# EasyEDA Pro project Jalousee PCB.eprj, schematic Jalousee PCB TC118S
Create Date: 2022-09-28; Page Name: P2; Project Name: Jalousee PCB; Schematic Name: Jalousee PCB TC118S; Update Date: 2023-08-31; Company: EasyEDA.com; Drawed: EasyEDA Pro; Page Size: A4; Part Number: JLCPCB-002; Reviewed: EasyEDA Pro; Version: V0.1
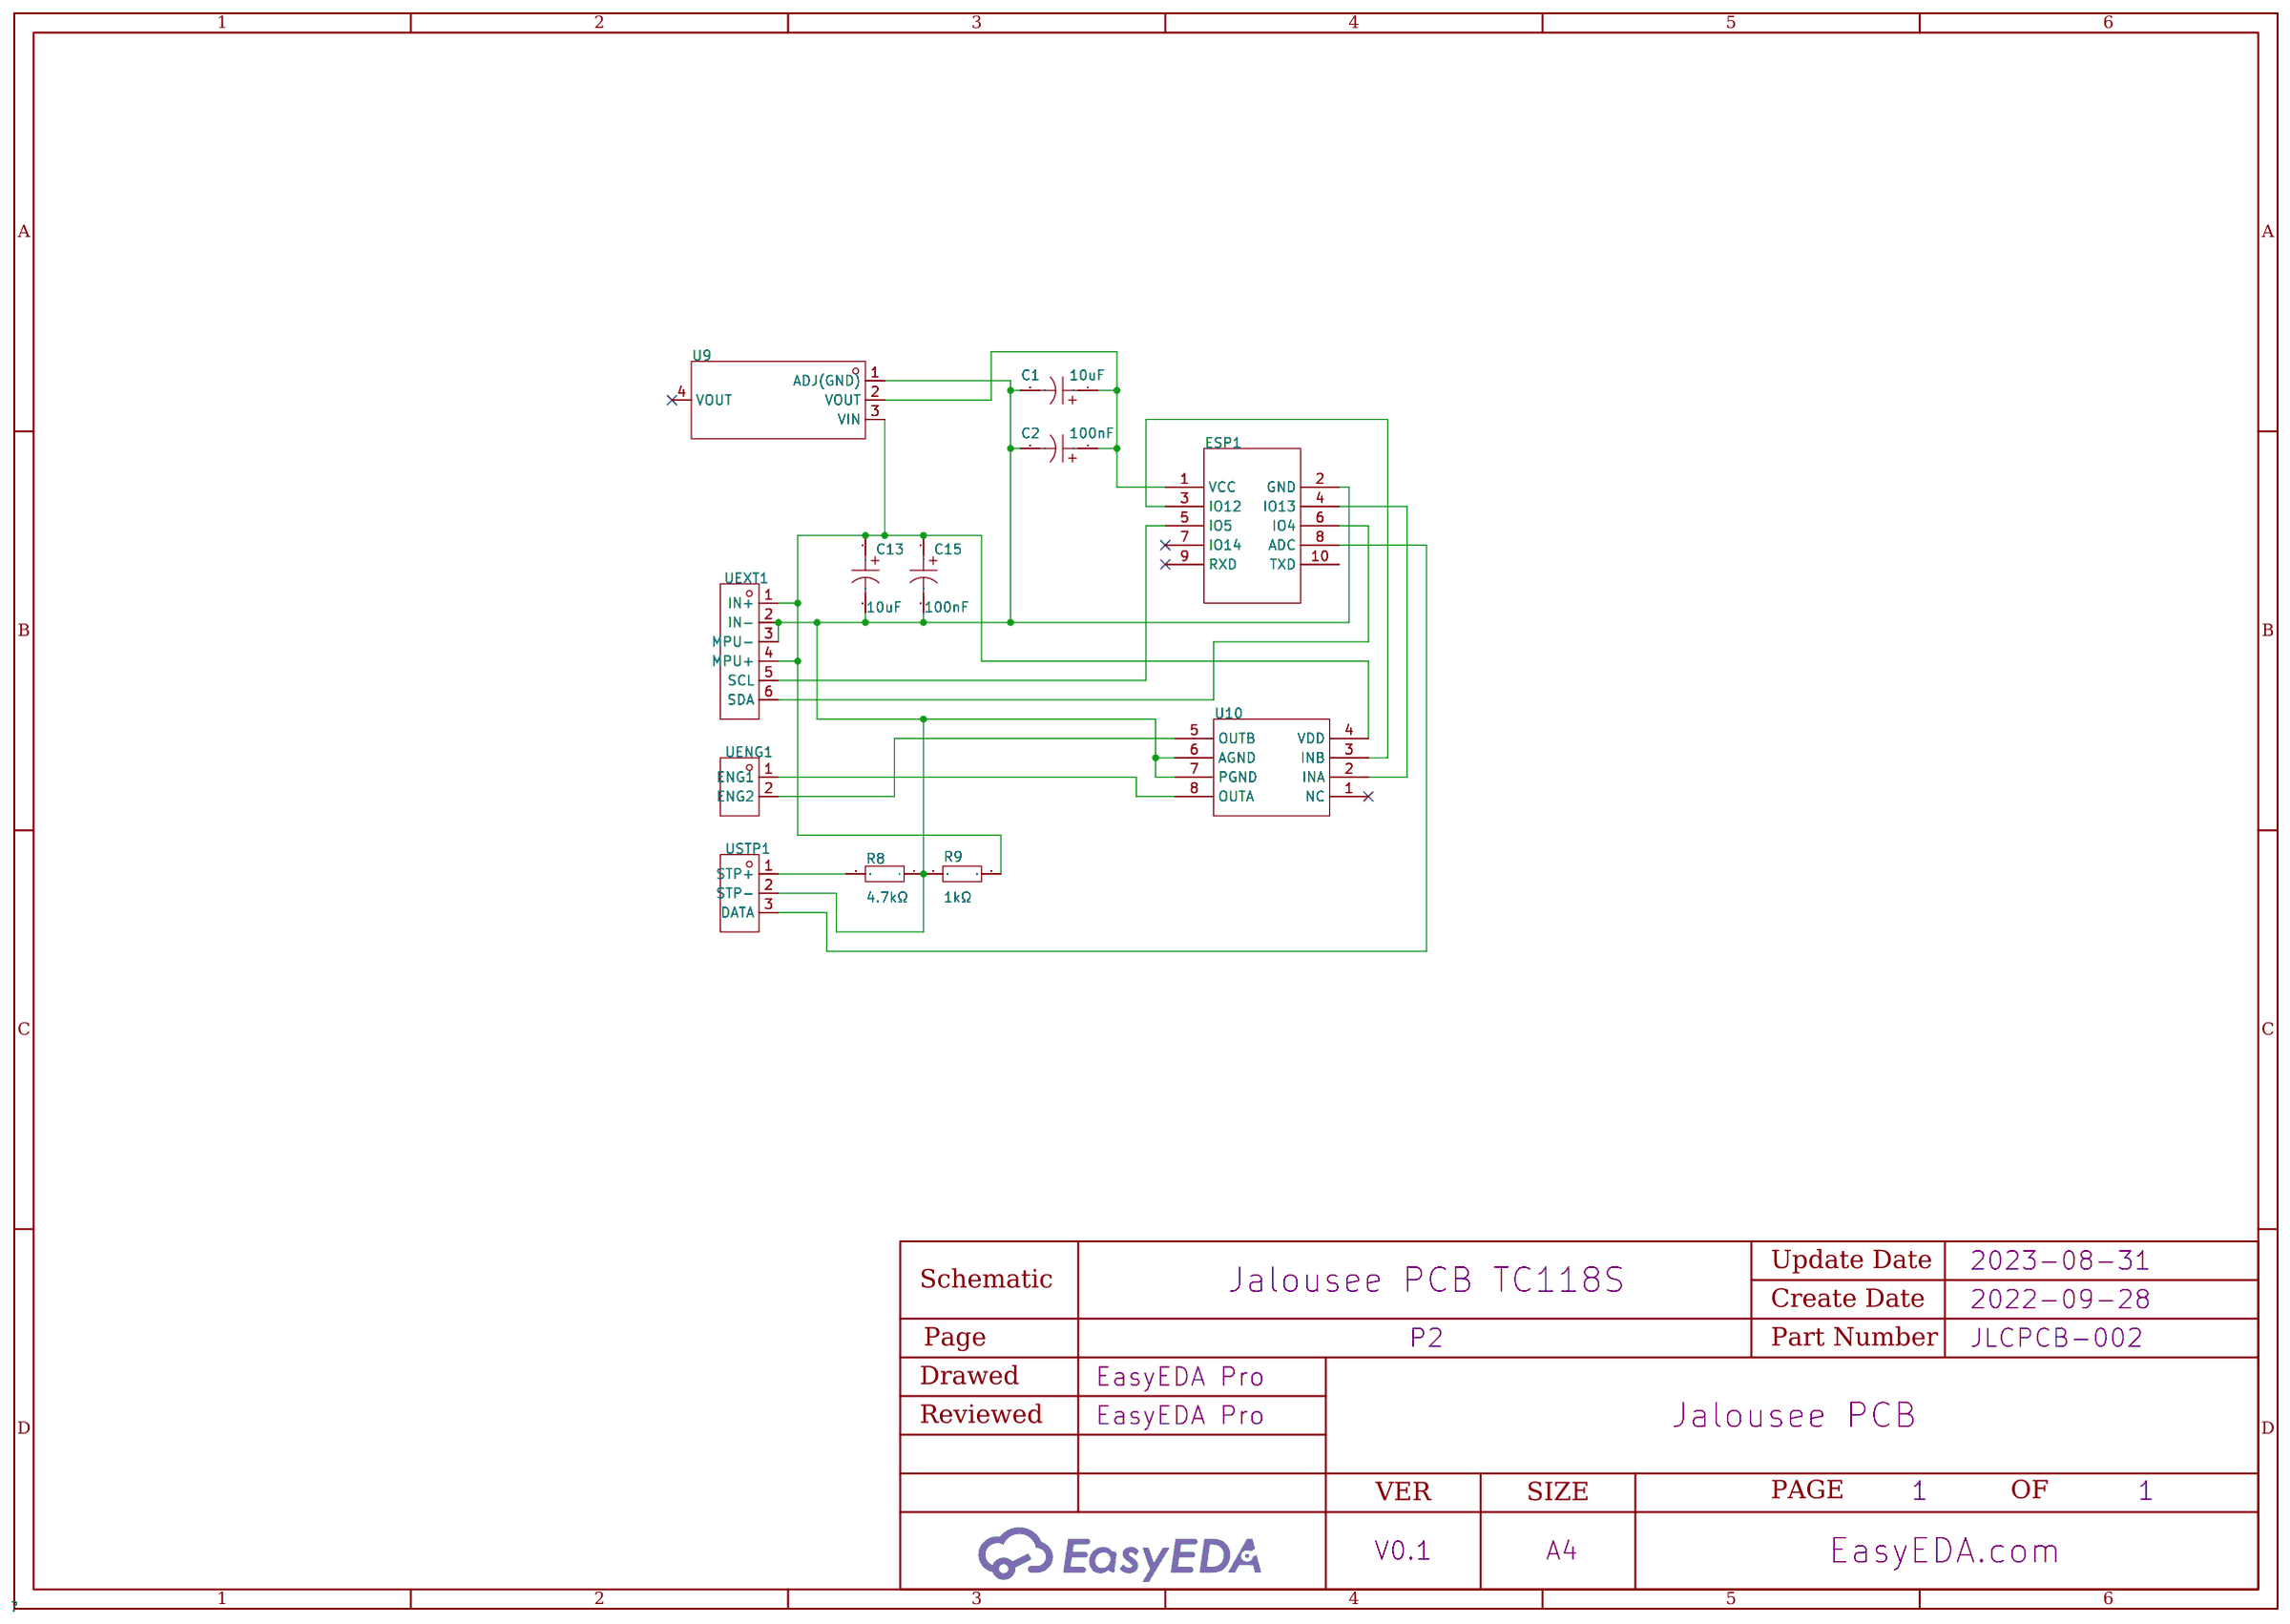
[diagram p2: schematic sheet]

## Parts
C1  10uF  [CAP-SMD_L2.0-W1.3-FD]
C2  100nF  [CAP-SMD_L3.2-W1.6-FD]
C13  10uF  [CAP-SMD_L2.0-W1.3-FD]
C15  100nF  [CAP-SMD_L3.2-W1.6-FD]
ESP1  -  [ESP12 10P]
R8  4.7kΩ  [R0603]
R9  1kΩ  [R0603]
U9  -  [SOT-223-3_L6.5-W3.4-P2.30-LS7.0-BR]
U10  -  [SOP-8_L4.9-W3.9-P1.27-LS6.0-BL]
UENG1  -  [CONN-TH_2P-P1.25_HCTL_HC-1.25-2A]
UEXT1  -  [HDR-TH_6P-P2.54-V-F]
USTP1  -  [CONN-TH_3P-P1.25_HCTL_HC-1.25-3A]

## Library data of the parts
C1 C13 = CA45-P-6.3V-10UF-K: Capacitance: Tolerance:±10% Tolerance:±10% Rated Voltage: Leakage Current(DCL):- Ripple Current:- Equivalent Series Resistance(ESR):-; LCSC Part Name: 10uF ±10% 6.3V; Supplier Part: C2844395; Manufacturer: CEC(振华新云); Supplier Footprint: CASE-P_2012; JLCPCB Part Class: Extended Part; Datasheet: https://atta.szlcsc.com/upload/public/pdf/source/20210702/C2844395_E7EBF1B65FEA8FC3CE954A9FCB08EE3D.pdf; Supplier: LCSC; Tolerance: ±10%
C2 C15 = T491A104M050AT: Capacitance:100nF Tolerance:±20% Tolerance:±20% Rated Voltage:50V Leakage Current(DCL):- Ripple Current:- Equivalent Series Resistance(ESR):20Ω Operating Temperature:-55~+125 Operating Temperature:-55~+125; LCSC Part Name: 100nF ±20% 50V; Supplier Part: C1952859; Manufacturer: KEMET(基美); Supplier Footprint: 1206; JLCPCB Part Class: Extended Part; Datasheet: https://atta.szlcsc.com/upload/public/pdf/source/20210416/95C0EC5B3581C9A90529545117ABEAC1.pdf; Supplier: LCSC; Tolerance: ±20%; Rated Voltage: 50V; Equivalent Series Resistance(ESR): 20Ω; Operating Temperature: -55~+125
ESP1 = ESP12-10P-3.3V-FH
R8 = RC0603JR-074K7L: Overload Voltage (Max): Operating Temperature Range: Operating Temperature Range: Body Length:- Tolerance: φD:- Body Height:- Body Width:- Resistance: Type:Thick Film Resistors Temperature Coefficient: Temperature Coefficient: Power(Watts):; LCSC Part Name: 4.7kΩ ±5%; Supplier Part: C105428; Manufacturer: YAGEO(国巨); Supplier Footprint: 0603; JLCPCB Part Class: Extended Part; Datasheet: https://atta.szlcsc.com/upload/public/pdf/source/20170413/1492062713212.pdf; Supplier: LCSC; Type: Thick Film Resistors
R9 = RC0603FR-071KL: Type:Thick Film Resistors Resistance: Tolerance:±1% Tolerance:±1% Power(Watts): Temperature Coefficient:±100ppm/ Temperature Coefficient:±100ppm/ Overload Voltage (Max): Operating Temperature Range:-55~+155 Operating Temperature Range:-55~+155; LCSC Part Name: 1kΩ ±1% 100mW; Supplier Part: C22548; Manufacturer: YAGEO(国巨); Supplier Footprint: 0603; JLCPCB Part Class: Extended Part; Datasheet: https://atta.szlcsc.com/upload/public/pdf/source/20180312/7BD3618A8B6324EA6280B0497A051AB7.pdf; Supplier: LCSC; Type: Thick Film Resistors; Tolerance: ±1%; Temperature Coefficient: ±100ppm/; Operating Temperature Range: -55~+155
U9 = AMS1117-3.3: Output Type:固定 Output Polarity:正 Number of Outputs:1 Maximum Input Voltage:18V Output Voltage:3.3V Output Voltage:3.3V Dropout Voltage:1.3V@(1A) Output Current:1A Power Supply Rejection Ratio (PSRR):60dB@(120Hz) Operating Temperature:±150@(Tj) Operating; LCSC Part Name: Vin=18V Vout=3.3V 1A 60dB@(120Hz); Supplier Part: C2891839; Manufacturer: YONGYUTAI(永裕泰); Supplier Footprint: SOT-223; JLCPCB Part Class: Extended Part; Datasheet: https://atta.szlcsc.com/upload/public/pdf/source/20210901/A75ADDE6A17DEE0002F2A58A8D1F3634.pdf; Supplier: LCSC; Output Type: 固定; Output Polarity: 正; Number of Outputs: 1; Maximum Input Voltage: 18V; Output Voltage: 3.3V; Dropout Voltage: 1.3V@(1A); Output Current: 1A; Power Supply Rejection Ratio (PSRR): 60dB@(120Hz); Operating Temperature: ±150@(Tj)
U10 = TC118S: Supplier Part: C88308; Manufacturer: FM富满; Supplier Footprint: SOP-8_150mil; JLCPCB Part Class: Extended Part; Datasheet: https://atta.szlcsc.com/upload/public/pdf/source/20161129/1480413782462.pdf; Supplier: LCSC
UENG1 = HC-1.25-2A: Reference Series:- Pitch:1.25mm Pins Structure:1x2P Number of Rows:1 Number of PINs Per Row:2 Row Spacing:- Gender:公型插针 Mounting Style:直插 Current Rating (Max):1A Operating Temperature Range:-25~+85 Operating Temperature Range:-25~+85; LCSC Part Name: 2P 间距P=1.25mm; Supplier Part: C2845520; Manufacturer: HCTL(华灿天禄); Supplier Footprint: 插件,P=1.25mm; JLCPCB Part Class: Extended Part; Datasheet: https://atta.szlcsc.com/upload/public/pdf/source/20210729/C2845520_89EAA22C8D4DE2FB8A253230326912FB.pdf; Supplier: LCSC; Pitch: 1.25mm; Pins Structure: 1x2P; Number of Rows: 1; Number of PINs Per Row: 2; Gender: 公型插针; Mounting Style: 直插; Current Rating (Max): 1A; Operating Temperature Range: -25~+85
UEXT1 = DM254R-11-06-85: Pitch:2.54mm Number of Holes:6 Number of Rows:1 Holes Structure:1x6P Row Spacing:- Mounting Type:直插 Circular Hole / Square Hole:方孔 Current Rating (Max):3A Voltage Rating (Max):- Holes Direction:顶部 Insulation Height:8.5mm Operating Temperature Range:- Oper; LCSC Part Name: 2.54mm 1x6P 180度 Y型; Supplier Part: C2935977; Manufacturer: DEALON(德艺隆); Supplier Footprint: 直插,P=2.54mm; JLCPCB Part Class: Extended Part; Datasheet: https://atta.szlcsc.com/upload/public/pdf/source/20220110/4E97995FE1BF9788ECBB6F72A9540C3B.pdf; Supplier: LCSC; Pitch: 2.54mm; Number of Holes: 6; Number of Rows: 1; Holes Structure: 1x6P; Mounting Type: 直插; Circular Hole / Square Hole: 方孔; Current Rating (Max): 3A; Holes Direction: 顶部; Insulation Height: 8.5mm
USTP1 = HC-1.25-3A: Reference Series:- Pitch:1.25mm Pins Structure:1x3P Number of Rows:1 Number of PINs Per Row:3 Row Spacing:- Gender:公型插针 Mounting Style:直插 Current Rating (Max):1A Operating Temperature Range:-25~+85 Operating Temperature Range:-25~+85; LCSC Part Name: 3P 间距P=1.25mm; Supplier Part: C2845521; Manufacturer: HCTL(华灿天禄); Supplier Footprint: 插件,P=1.25mm; JLCPCB Part Class: Extended Part; Datasheet: https://atta.szlcsc.com/upload/public/pdf/source/20210729/C2845520_89EAA22C8D4DE2FB8A253230326912FB.pdf; Supplier: LCSC; Pitch: 1.25mm; Pins Structure: 1x3P; Number of Rows: 1; Number of PINs Per Row: 3; Gender: 公型插针; Mounting Style: 直插; Current Rating (Max): 1A; Operating Temperature Range: -25~+85

## Nets
$1N603: ESP1.3(IO12) U10.3(INB)
$1N605: ESP1.4(IO13) U10.2(INA)
$1N607: C1.1 C2.1 ESP1.1(VCC) U9.2(VOUT)
$1N608: U10.5(OUTB) UENG1.2(ENG2)
$1N610: U10.8(OUTA) UENG1.1(ENG1)
$1N611: C13.1 C15.1 R9.2 U9.3(VIN) U10.4(VDD) UEXT1.1(IN+) UEXT1.4(MPU+)
$1N5181: ESP1.5(IO5) UEXT1.5(SCL)
$1N5352: ESP1.6(IO4) UEXT1.6(SDA)
$1N12303: C1.2 C2.2 C13.2 C15.2 ESP1.2(GND) R8.1 R9.1 U9.1(ADJ(GND)) U10.6(AGND) U10.7(PGND) UEXT1.2(IN-) UEXT1.3(MPU-) USTP1.2(STP-)
$1N12304: ESP1.8(ADC) USTP1.3(DATA)
$1N12305: R8.2 USTP1.1(STP+)

Not connected (* = marked no-connect by the designer): ESP1 7(IO14)* 9(RXD)* 10(TXD); U9 4(VOUT)*; U10 1(NC)*
